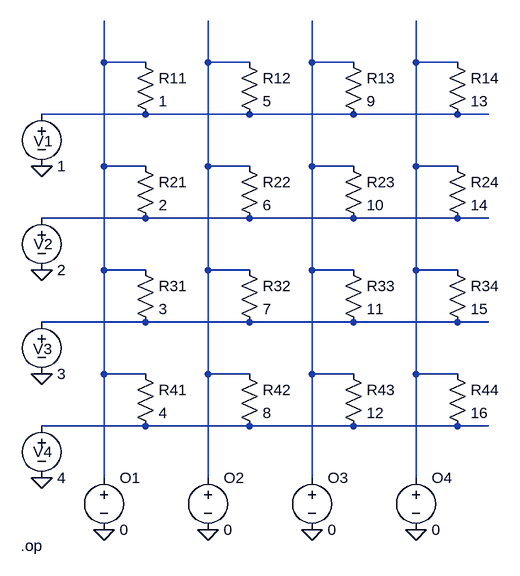
[diagram p0: schematic Crossbar-MVM.asc]
Crossbar-MVM.asc, the LTspice schematic file:
Version 4
SHEET 1 880 840
WIRE 16 80 16 16
WIRE 80 80 16 80
WIRE 176 80 176 16
WIRE 240 80 176 80
WIRE 336 80 336 16
WIRE 400 80 336 80
WIRE 496 80 496 16
WIRE 560 80 496 80
WIRE 80 160 -80 160
WIRE 240 160 80 160
WIRE 400 160 240 160
WIRE 560 160 400 160
WIRE 608 160 560 160
WIRE 16 240 16 80
WIRE 80 240 16 240
WIRE 176 240 176 80
WIRE 240 240 176 240
WIRE 336 240 336 80
WIRE 400 240 336 240
WIRE 496 240 496 80
WIRE 560 240 496 240
WIRE 80 320 -80 320
WIRE 240 320 80 320
WIRE 400 320 240 320
WIRE 560 320 400 320
WIRE 608 320 560 320
WIRE 16 400 16 240
WIRE 80 400 16 400
WIRE 176 400 176 240
WIRE 240 400 176 400
WIRE 336 400 336 240
WIRE 400 400 336 400
WIRE 496 400 496 240
WIRE 560 400 496 400
WIRE 80 480 -80 480
WIRE 240 480 80 480
WIRE 400 480 240 480
WIRE 560 480 400 480
WIRE 608 480 560 480
WIRE 16 560 16 400
WIRE 80 560 16 560
WIRE 176 560 176 400
WIRE 240 560 176 560
WIRE 336 560 336 400
WIRE 400 560 336 560
WIRE 496 560 496 400
WIRE 560 560 496 560
WIRE 80 640 -80 640
WIRE 240 640 80 640
WIRE 400 640 240 640
WIRE 560 640 400 640
WIRE 608 640 560 640
WIRE 16 720 16 560
WIRE 176 720 176 560
WIRE 336 720 336 560
WIRE 496 720 496 560
FLAG 16 800 0
FLAG -80 240 0
FLAG -80 400 0
FLAG -80 560 0
FLAG -80 720 0
FLAG 176 800 0
FLAG 336 800 0
FLAG 496 800 0
SYMBOL res 64 64 R0
SYMATTR InstName R11
SYMATTR Value 1
SYMBOL res 64 224 R0
SYMATTR InstName R21
SYMATTR Value 2
SYMBOL res 64 384 R0
SYMATTR InstName R31
SYMATTR Value 3
SYMBOL res 64 544 R0
SYMATTR InstName R41
SYMATTR Value 4
SYMBOL res 224 64 R0
SYMATTR InstName R12
SYMATTR Value 5
SYMBOL res 224 224 R0
SYMATTR InstName R22
SYMATTR Value 6
SYMBOL res 224 384 R0
SYMATTR InstName R32
SYMATTR Value 7
SYMBOL res 224 544 R0
SYMATTR InstName R42
SYMATTR Value 8
SYMBOL res 384 64 R0
SYMATTR InstName R13
SYMATTR Value 9
SYMBOL res 384 224 R0
SYMATTR InstName R23
SYMATTR Value 10
SYMBOL res 384 384 R0
SYMATTR InstName R33
SYMATTR Value 11
SYMBOL res 384 544 R0
SYMATTR InstName R43
SYMATTR Value 12
SYMBOL res 544 64 R0
SYMATTR InstName R14
SYMATTR Value 13
SYMBOL res 544 224 R0
SYMATTR InstName R24
SYMATTR Value 14
SYMBOL res 544 384 R0
SYMATTR InstName R34
SYMATTR Value 15
SYMBOL res 544 544 R0
SYMATTR InstName R44
SYMATTR Value 16
SYMBOL voltage -80 144 R0
WINDOW 0 -12 57 Left 2
SYMATTR InstName V1
SYMATTR Value 1
SYMBOL voltage -80 304 R0
WINDOW 0 -12 56 Left 2
SYMATTR InstName V2
SYMATTR Value 2
SYMBOL voltage -80 464 R0
WINDOW 0 -13 57 Left 2
SYMATTR InstName V3
SYMATTR Value 3
SYMBOL voltage -80 624 R0
WINDOW 0 -13 56 Left 2
SYMATTR InstName V4
SYMATTR Value 4
SYMBOL voltage 16 704 R0
SYMATTR InstName O1
SYMATTR Value 0
SYMBOL voltage 176 704 R0
SYMATTR InstName O2
SYMATTR Value 0
SYMBOL voltage 336 704 R0
SYMATTR InstName O3
SYMATTR Value 0
SYMBOL voltage 496 704 R0
SYMATTR InstName O4
SYMATTR Value 0
TEXT -112 824 Left 2 !.op

The netlist it stands for:
* Crossbar-MVM.asc
R11 N001 N005 1
R21 N001 N006 2
R31 N001 N007 3
R41 N001 N008 4
R12 N002 N005 5
R22 N002 N006 6
R32 N002 N007 7
R42 N002 N008 8
R13 N003 N005 9
R23 N003 N006 10
R33 N003 N007 11
R43 N003 N008 12
R14 N004 N005 13
R24 N004 N006 14
R34 N004 N007 15
R44 N004 N008 16
V1 N005 0 1
V2 N006 0 2
V3 N007 0 3
V4 N008 0 4
V§O1 N001 0 0
V§O2 N002 0 0
V§O3 N003 0 0
V§O4 N004 0 0
.op
.backanno
.end